# Altium schematic sheet Power.SchDoc
size A4
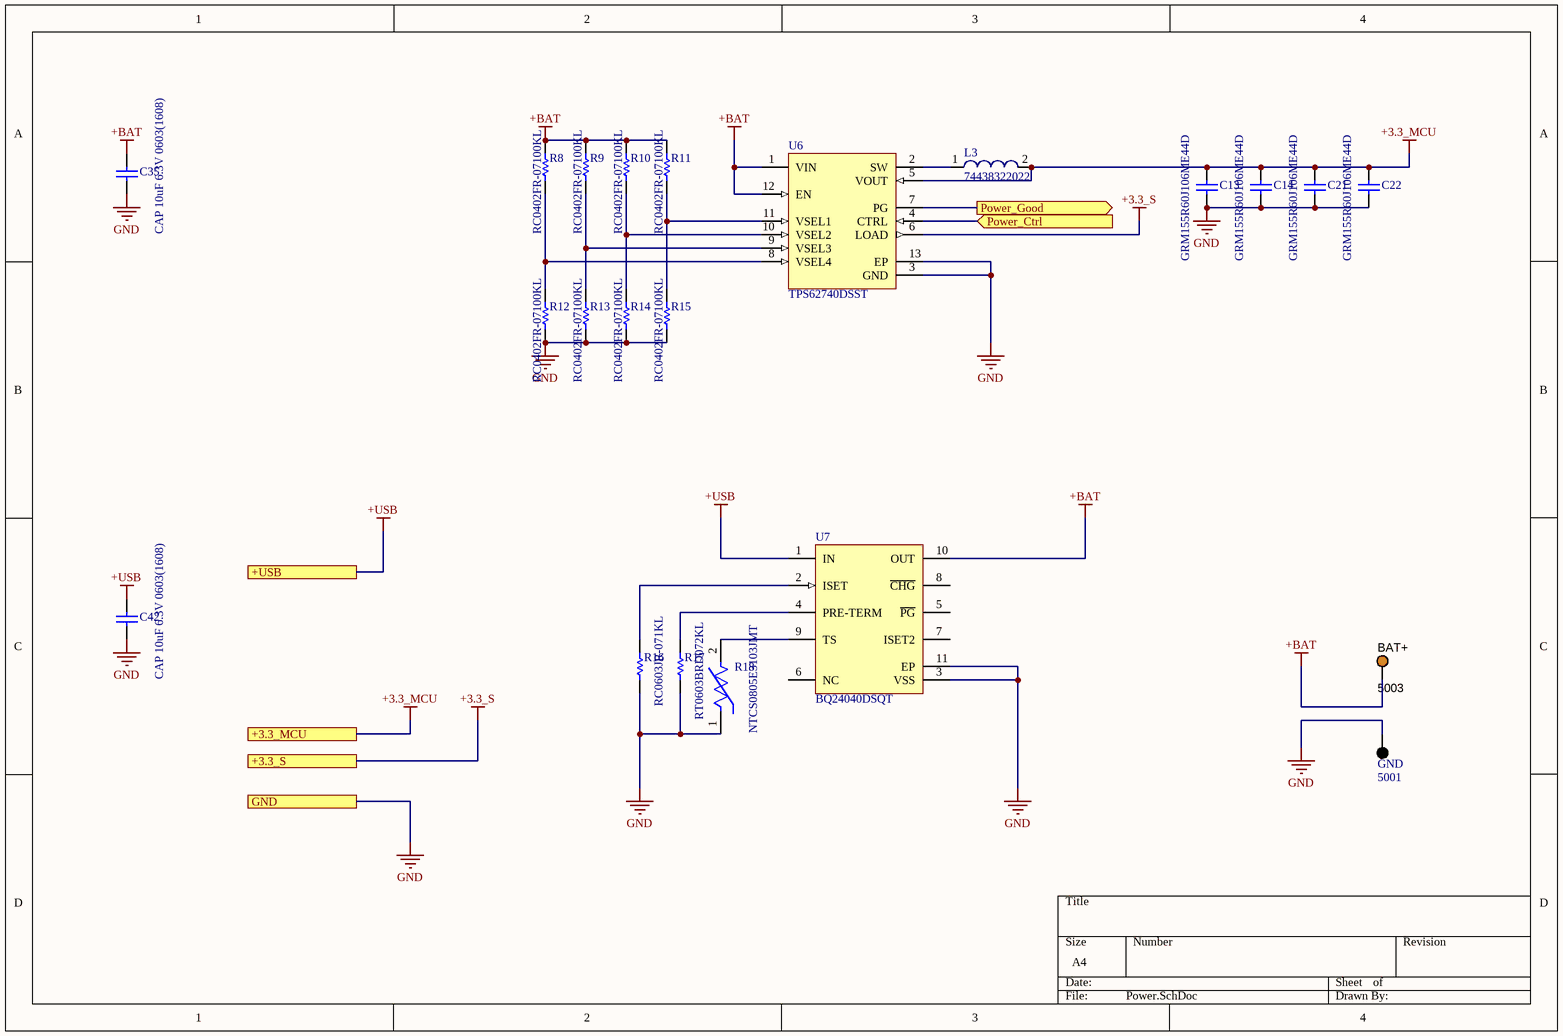
[diagram p0: Power.SchDoc]

## Parts
BAT+  5003  [KSTN-5003]
C13  GRM155R60J106ME44D  [MURA-GRM155R60J106ME44D-2_M]
C14  GRM155R60J106ME44D  [MURA-GRM155R60J106ME44D-2_M]
C21  GRM155R60J106ME44D  [MURA-GRM155R60J106ME44D-2_M]
C22  GRM155R60J106ME44D  [MURA-GRM155R60J106ME44D-2_M]
C35  CAP 10uF 6.3V 0603(1608)  [CAPC0603(1608)100_N]
C42  CAP 10uF 6.3V 0603(1608)  [CAPC0603(1608)100_N]
GND  5001  [KSTN-5001]
L3  74438322022  [SMD 2508]
R8  RC0402FR-07100KL  [RESC1005X40X25NL05T10]
R9  RC0402FR-07100KL  [RESC1005X40X25NL05T10]
R10  RC0402FR-07100KL  [RESC1005X40X25NL05T10]
R11  RC0402FR-07100KL  [RESC1005X40X25NL05T10]
R12  RC0402FR-07100KL  [RESC1005X40X25NL05T10]
R13  RC0402FR-07100KL  [RESC1005X40X25NL05T10]
R14  RC0402FR-07100KL  [RESC1005X40X25NL05T10]
R15  RC0402FR-07100KL  [RESC1005X40X25NL05T10]
R16  RC0603JR-071KL  [RESC1608X55X25ML10T15]
R17  RT0603BRD072KL  [RESC1608X55X25ML10T15]
R18  NTCS0805E3103JMT  [FP-NTCS0805-MFG]
U6  TPS62740DSST  [DSS0012A_V]
U7  BQ24040DSQT  [DSQ0010A_V]

## Ports
+3.3_MCU, +3.3_S, +USB, GND, Power_Ctrl (in), Power_Good (out)

## Nets
+3.3_MCU: C13.2 C14.2 C21.2 C22.2 L3.2 U6.5(VOUT) ; port +3.3_MCU
+3.3_S: U6.6(LOAD) ; port +3.3_S
+BAT: BAT+.1 C35.2 R8.2 R9.2 R10.2 R11.2 U6.1(VIN) U6.12(EN) U7.10(OUT)
+USB: C42.2 U7.1(IN) ; port +USB
GND: C13.1 C14.1 C21.1 C22.1 C35.1 C42.1 GND.1 R12.1 R13.1 R14.1 R15.1 R16.1 R17.1 R18.1 U6.3(GND) U6.13(EP) U7.3(VSS) U7.11(EP) ; port GND
Power_Ctrl: U6.4(CTRL) ; port Power_Ctrl
Power_Good: U6.7(PG) ; port Power_Good
NetL3_1: L3.1 U6.2(SW)
NetR8_1: R8.1 R12.2 U6.8(VSEL4)
NetR9_1: R9.1 R13.2 U6.9(VSEL3)
NetR10_1: R10.1 R14.2 U6.10(VSEL2)
NetR11_1: R11.1 R15.2 U6.11(VSEL1)
NetR16_2: R16.2 U7.2(ISET)
NetR17_2: R17.2 U7.4(PRE-TERM)
NetR18_2: R18.2 U7.9(TS)

Not connected (* = marked no-connect by the designer): U7 5(~{PG}) 6(NC) 7(ISET2) 8(~{CHG})

## Library data of the parts
BAT+ = CMP-1672-00009-1: Test Point, Orange, 1-Pin THD, RoHS; Peak Reverse Current: 600 uA; Forward Current: 3 A; Max Surge Current: 80 A; Forward Voltage: 1.08 V; Max Operating Temperature: 150 degC; PackageReference: 5003; Pins: 2; ComponentLink2URL: http://keyelco.com/userAssets/file/M65p56.pdf; PackageDescription: 1-Pin Through Hole Device, Dia 2.54 mm; Weight: 0.01 lb; Diameter: 5.3 mm; Mount: Through Hole; Package Quantity: 500; Packaging: Bulk; Min Operating Temperature: -65 degC; ComponentLink1Description: Manufacturer URL; Height: 0.25 inch; ComponentLink1URL: http://www.keyelco.com/; ComponentLink2Description: Datasheet; Width: 0.25 inch; REACH SVHC: No SVHC; RoHSCompliant: true; Radiation Hardening: No; Length: 9.5 mm; DatasheetVersion: Jun-15
C13 C14 C21 C22 = CMP-2000-05265-1: Chip Monolithic Ceramic Capacitor, 10 uF, +/- 20%, 6.3 V, -55 to 85 degC, 0402 (1005 Metric), RoHS, Tape and Reel; Manufacturer: Murata; Case Height: 0.5mm; Capacitance: 10uF; Type: GeneralPurposeMLCC; Temperature Coefficient / Code: +/-15%; Case Length: 1mm; Brand: MurataElectronics; Voltage Rating DC: 6.3V; Dielectric: X5R; Factory Pack Quantity: 10000; Manufacturer URL: http://www.murata.com/; Tolerance: 20%; Case Width: 0.5mm; Maximum Operating Temperature: +85C; Datasheet Version: Feb-13; Packaging: Reel; Product: GeneralTypeMLCCs; Case Code - in: 0402; Minimum Operating Temperature: -55C; Dimensions: 0.5mmWx1mmLx0.5mmH; Datasheet URL: http://download.siliconexpert.com/pdfs/2013/2/7/7/4/54/372/mrt_/manual/grm155r60j106me44d.pdf; Package / Case: 0402(1005metric); Series: GRM; Termination Style: SMD/SMT; Operating Temperature Range: -55Cto+85C; Voltage Rating: 6.3V; Case Code - mm: 1005; Product Category: MultilayerCeramicCapacitorsMLCC-SMD/SMT
C35 C42 = CMP-1035-02797-1: CAP 10uF 6.3V ±20% 0603 (1608 Metric) Thickness 1mm SMD; Case-Metric: 1608; Case-EIA: 0603; Tolerance: Â±20%; Value: 10uF; Technology: SMT; Max Thickness: 1 mm; Rated Voltage: 6.3 V
GND = CMP-2000-05181-1: Test Point, Black, 1-Pin THD, RoHS, Bulk; Manufacturer: Keystone; Other Names: 5001K; Catalog Drawings: 5000Series; Alternate Color: 5004K-ND / -TESTPOINTPCMINI.040"DYELLOW / 5003K-ND / -TESTPOINTPCMINI.040"DORANGE / 5002K-ND / -TESTPOINTPCMINI.040"DWHITE / 5000K-ND / -TESTPOINTPCMINI.040"DRED; Kits: DKTGRS232C-KIT-ND / -TTLCONVERTER; Online Catalog: ColorCodedTestPoints; Datasheet URL: https://ciiva.com/datasheet-click-2917627?src=ciiva&sig=bd195616; Mounting Type: 0.040"(1.02mm)HoleDiameter; Family: TestPoints; RoHS Information: RoHSComplianceStatement; Datasheet Version: Rev. G, 12/2008; Color: Black; Category: TestandMeasurement; Standard Package: 100; Manufacturer URL: http://www.keyelco.com/; Material: Base,Nylon46,UL94V-0; Type: PCTestPoint,Miniature; Terminal: 0.010"x0.020"(0.25mmx0.51mm)PhosphorBronzeWire,SilverPlated; Series: THM; Packaging: Bulk
L3 = CMP-1411-00004-1: Power Multilayer Inductor WE-MAPI, L=2.2µH; Manufacturer: Wuerth Elektronik; Inductance: 2.2ÂµH; ComponentLink2URL: http://katalog.we-online.de/kataloge/eisos/media/pdf/74438322022.pdf; ComponentLink1Description: Manufacturer URL; ComponentLink2Description: Datasheet; ComponentLink1URL: http://www.we-online.com; PartNumber: 74438322022; PackageReference: SMD 2508
R8-R15 = CMP-2002-07343-1: Manufacturer: Yageo / Phycomp; Part Number: RC0402FR-07100KL
R16 = CMP-2000-05023-1: Chip Resistor, 1 KOhm, +/- 5%, 0.063 W, -55 to 155 degC, 0603 (1608 Metric), RoHS, Tape and Reel; Manufacturer: Yageo; Resistor Case Style: 0603[1608Metric]; Resistor Element Type: ThickFilm; Product Range: RCSeries; Resistance: 1kohm; SVHC: ToBeAdvised; Voltage Rating: 50V; Temperature Coefficient: ±100ppm/degC; Power Rating: 100mW; Packaging: CutTape; Manufacturer URL: http://www.yageo.com/; Resistance Tolerance: ±5%; Datasheet Version: Rev. 4, 04/2009; MSL: MSL1-Unlimited; Package Description: 2-Pin Surface Mount Device, Body 1.6 x 0.8 mm; Automotive Qualification Standard: -; Package Reference: 603; Datasheet URL: https://datasheet.ciiva.com/2452/pyu-rc0603-51-rohs-l-4-2452848.pdf
R17 = CMP-2000-04430-1: Manufacturer: Yageo; Part Number: RT0603BRD072KL
R18 = CMP-02404-000004-1: THERMISTOR NTC 10KOHM 3570K 0805; Manufacturer: Vishay BC Components; Automotive Grade: Grade 0; Power Rating: 210mW; B Tolerance: 3%; Value: 10kΩ; Tolerance: 5%; Automotive: Yes; Category: Res; Lead Free: Yes; Height: 0.95mm; RoHS: TRUE; Temperature Range Low: -40°C; Temperature: -40°C to +150°C; Device Class L2: Resistors; Digikey Description: THERMISTOR NTC 10KOHM 3570K 0805; ComponentLink2URL: http://www.vishay.com/docs/29044/ntcs0805e3t.pdf; Mouser Description: Thermistors - NTC 10K OHM 5%; Octopart: https://octopart.com/ntcs0805e3103jmt-vishay-39723061; Package: NTCS0805; B 25 85: 3570K; Series: NTCS0805E; Resistance: 10kΩ; Device Class L1: Passive Components; Ipc Land Pattern Name: RESC200125X80; Manufacturer Part Number: NTCS0805E3103JMT; Device Class L3: Thermistors; ComponentLink2Description: Datasheet; Temperature Range High: +150°C
U6 = CMP-0323-00573-2: Step Down Converter For Low Power Applications, 2.2 to 5.5 V VIN, -40 to 85 degC, 12-Pin WSON (DSS), RoHS, Tape and Reel; VIN Min: 2.2 V; VOUT Max: 3.3 V; VOUT Min: 1.8 V; VIN Max: 5.5 V; PackageVersion: 4209244/C, 07/2011; ComponentLink1URL: http://www.ti.com/; Packing: Tape and Reel; PartNumber: TPS62740; ComponentLink2URL: http://www.ti.com/lit/ds/symlink/tps62740.pdf; RoHS: TRUE; ComponentLink3Description: Package Specification; Temperature Min: -40 degC; ComponentLink1Description: Manufacturer URL; PackageReference: DSS0012A; ComponentLink2Description: Datasheet; DatasheetVersion: SLVSB02B; Temperature Max: 85 degC; ComponentLink3URL: http://www.ti.com/litv/pdf/mpds336b; PackageDescription: 12-Pin Plastic Small Outline, Body 3 x 2 mm, Pitch 0.5 mm; Mounting Technology: Surface Mount
U7 = CMP-0321-00457-2: 800 mA, Single-Input, Single Cell Li-Ion Battery Charger with Auto Start. Vovp=6.6 V, 3.5 V, -40 to 85 degC, 10-pin SON (DSQ), Green (RoHS & no Sb/Br); Manufacturer: Texas Instruments; Lead Acid: N; SubFamily: Battery Charge Management; Vin(Min)(V): 3.5; PackageReference: DSQ0010A; NiMH: N; DatasheetVersion: SLUS941A; Over Voltage Protection: N; PackageDescription: 10-Pin Plastic Small Outline No-Lead, 2 x 2 x 0.8 mm Body, 0.4 mm Pitch, Exposed Pad; Li-Polymer: N; Li-Ion: N; ComponentLink1Description: Datasheet; ComponentLink1URL: http://www.ti.com/general/docs/lit/getliterature.tsp?genericPartNumber=BQ24040&fileType=pdf; PartNumber: BQ24040DSQT; NiCd: N; Eco-Plan: Green (RoHS & no Sb/Br); Mounting Technology: Surface Mount; PackageVersion: revB, Apr-2010